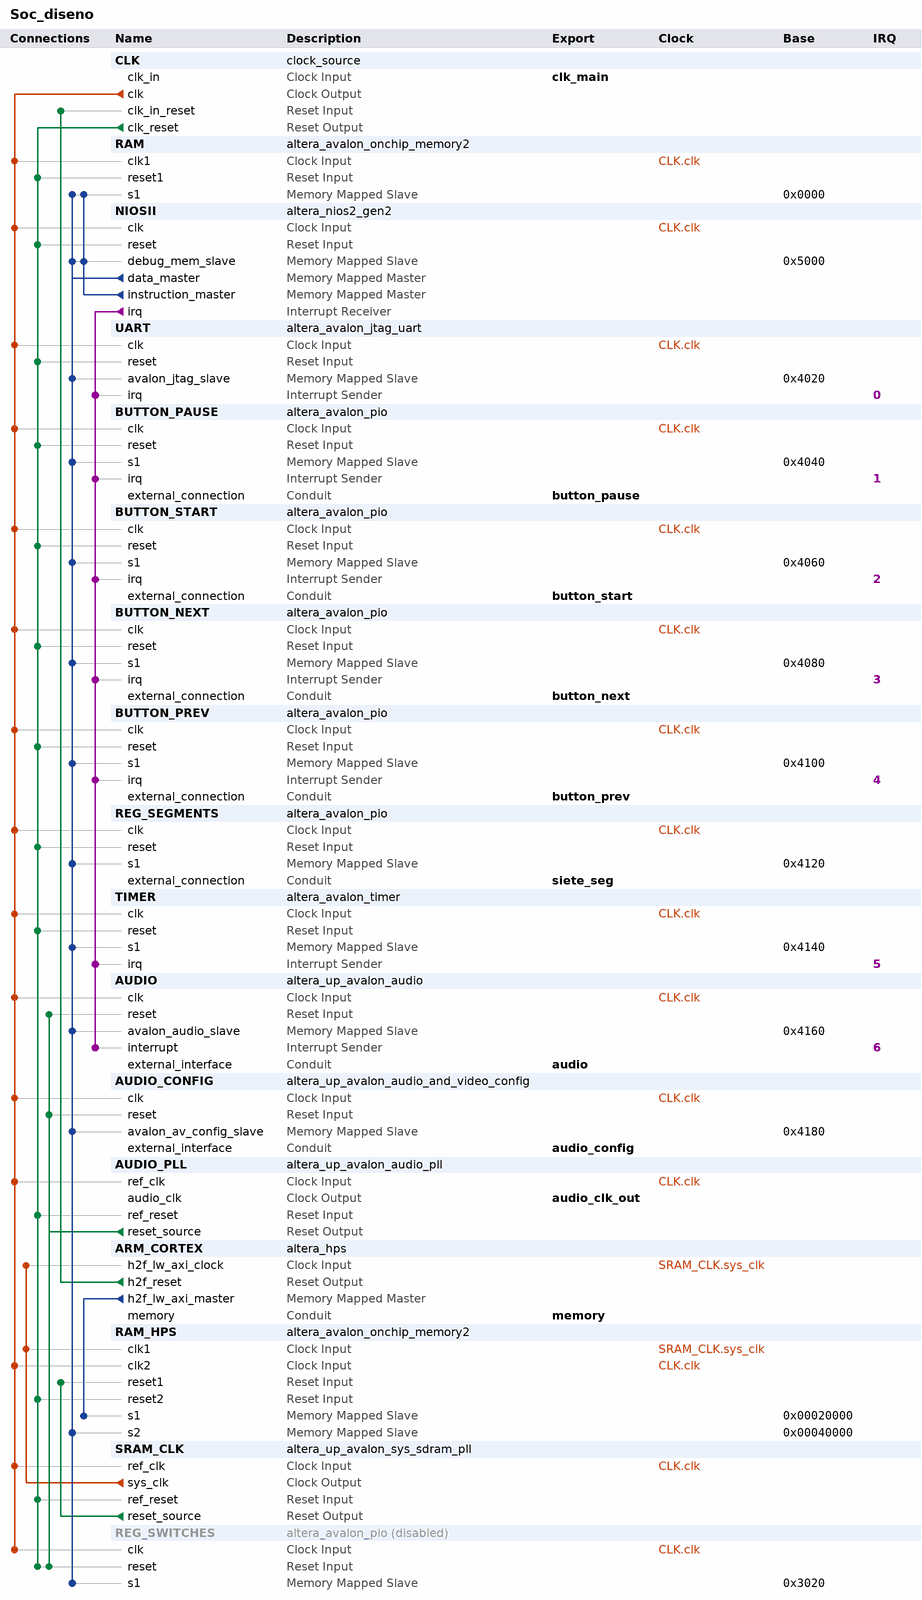
[diagram p0: system contents]
# Platform Designer (Qsys) system Soc_diseno, Cyclone V 5CSEMA5F31C6
# Parameters at their usual value, and those the tool derives, are not listed.
package require -exact qsys 18.1
create_system Soc_diseno
set_project_property DEVICE_FAMILY {Cyclone V}
set_project_property DEVICE 5CSEMA5F31C6

add_instance CLK clock_source 18.1
set_instance_parameter_value CLK clockFrequency 50000000

add_instance RAM altera_avalon_onchip_memory2 18.1
set_instance_parameter_value RAM dataWidth 32
set_instance_parameter_value RAM dualPort false
set_instance_parameter_value RAM initMemContent true
set_instance_parameter_value RAM initializationFileName onchip_mem.hex
set_instance_parameter_value RAM memorySize 16384

add_instance NIOSII altera_nios2_gen2 18.1
set_instance_parameter_value NIOSII dcache_size 2048
set_instance_parameter_value NIOSII exceptionSlave RAM.s1
set_instance_parameter_value NIOSII icache_size 4096
set_instance_parameter_value NIOSII impl Tiny
set_instance_parameter_value NIOSII resetSlave RAM.s1

add_instance UART altera_avalon_jtag_uart 18.1
set_instance_parameter_value UART simInteractiveOptions NO_INTERACTIVE_WINDOWS

add_instance BUTTON_PAUSE altera_avalon_pio 18.1
set_instance_parameter_value BUTTON_PAUSE bitClearingEdgeCapReg true
set_instance_parameter_value BUTTON_PAUSE captureEdge true
set_instance_parameter_value BUTTON_PAUSE direction Input
set_instance_parameter_value BUTTON_PAUSE edgeType FALLING
set_instance_parameter_value BUTTON_PAUSE generateIRQ true
set_instance_parameter_value BUTTON_PAUSE irqType EDGE
set_instance_parameter_value BUTTON_PAUSE width 1

add_instance BUTTON_START altera_avalon_pio 18.1
set_instance_parameter_value BUTTON_START bitClearingEdgeCapReg true
set_instance_parameter_value BUTTON_START captureEdge true
set_instance_parameter_value BUTTON_START direction Input
set_instance_parameter_value BUTTON_START edgeType FALLING
set_instance_parameter_value BUTTON_START generateIRQ true
set_instance_parameter_value BUTTON_START irqType EDGE
set_instance_parameter_value BUTTON_START width 1

add_instance BUTTON_NEXT altera_avalon_pio 18.1
set_instance_parameter_value BUTTON_NEXT bitClearingEdgeCapReg true
set_instance_parameter_value BUTTON_NEXT captureEdge true
set_instance_parameter_value BUTTON_NEXT direction Input
set_instance_parameter_value BUTTON_NEXT edgeType FALLING
set_instance_parameter_value BUTTON_NEXT generateIRQ true
set_instance_parameter_value BUTTON_NEXT irqType EDGE
set_instance_parameter_value BUTTON_NEXT width 1

add_instance BUTTON_PREV altera_avalon_pio 18.1
set_instance_parameter_value BUTTON_PREV bitClearingEdgeCapReg true
set_instance_parameter_value BUTTON_PREV captureEdge true
set_instance_parameter_value BUTTON_PREV direction Input
set_instance_parameter_value BUTTON_PREV edgeType FALLING
set_instance_parameter_value BUTTON_PREV generateIRQ true
set_instance_parameter_value BUTTON_PREV irqType EDGE
set_instance_parameter_value BUTTON_PREV width 1

add_instance REG_SEGMENTS altera_avalon_pio 18.1
set_instance_parameter_value REG_SEGMENTS direction Output
set_instance_parameter_value REG_SEGMENTS width 28

add_instance TIMER altera_avalon_timer 18.1
set_instance_parameter_value TIMER fixedPeriod true
set_instance_parameter_value TIMER period 1
set_instance_parameter_value TIMER periodUnits SEC

add_instance AUDIO altera_up_avalon_audio 18.0
set_instance_parameter_value AUDIO audio_in false
set_instance_parameter_value AUDIO avalon_bus_type {Memory Mapped}
set_instance_parameter_value AUDIO dw 16

add_instance AUDIO_CONFIG altera_up_avalon_audio_and_video_config 18.0
set_instance_parameter_value AUDIO_CONFIG audio_in {Microphone to ADC}
set_instance_parameter_value AUDIO_CONFIG bit_length 16
set_instance_parameter_value AUDIO_CONFIG board DE1-SoC
set_instance_parameter_value AUDIO_CONFIG line_in_bypass false
set_instance_parameter_value AUDIO_CONFIG sampling_rate {48 kHz}

add_instance AUDIO_PLL altera_up_avalon_audio_pll 18.0
set_instance_parameter_value AUDIO_PLL gui_refclk 50.0

add_instance ARM_CORTEX altera_hps 18.1
set_instance_parameter_value ARM_CORTEX EMAC1_Mode N/A
set_instance_parameter_value ARM_CORTEX EMAC1_PinMuxing Unused
set_instance_parameter_value ARM_CORTEX F2SCLK_COLDRST_Enable false
set_instance_parameter_value ARM_CORTEX F2SCLK_DBGRST_Enable false
set_instance_parameter_value ARM_CORTEX F2SCLK_WARMRST_Enable false
set_instance_parameter_value ARM_CORTEX F2SINTERRUPT_Enable false
set_instance_parameter_value ARM_CORTEX F2S_Width 0
set_instance_parameter_value ARM_CORTEX FPGA_PERIPHERAL_OUTPUT_CLOCK_FREQ_EMAC0_GTX_CLK 125
set_instance_parameter_value ARM_CORTEX FPGA_PERIPHERAL_OUTPUT_CLOCK_FREQ_EMAC0_MD_CLK 2.5
set_instance_parameter_value ARM_CORTEX FPGA_PERIPHERAL_OUTPUT_CLOCK_FREQ_EMAC1_GTX_CLK 125
set_instance_parameter_value ARM_CORTEX FPGA_PERIPHERAL_OUTPUT_CLOCK_FREQ_EMAC1_MD_CLK 2.5
set_instance_parameter_value ARM_CORTEX HPS_PROTOCOL DDR3
set_instance_parameter_value ARM_CORTEX I2C0_Mode N/A
set_instance_parameter_value ARM_CORTEX I2C0_PinMuxing Unused
set_instance_parameter_value ARM_CORTEX I2C1_Mode N/A
set_instance_parameter_value ARM_CORTEX I2C1_PinMuxing Unused
set_instance_parameter_value ARM_CORTEX LWH2F_Enable true
set_instance_parameter_value ARM_CORTEX MEM_BANKADDR_WIDTH 3
set_instance_parameter_value ARM_CORTEX MEM_CLK_FREQ 300.0
set_instance_parameter_value ARM_CORTEX MEM_CLK_FREQ_MAX 400.0
set_instance_parameter_value ARM_CORTEX MEM_COL_ADDR_WIDTH 8
set_instance_parameter_value ARM_CORTEX MEM_DQ_WIDTH 8
set_instance_parameter_value ARM_CORTEX MEM_DRV_STR RZQ/6
set_instance_parameter_value ARM_CORTEX MEM_ROW_ADDR_WIDTH 12
set_instance_parameter_value ARM_CORTEX MEM_RTT_NOM {ODT Disabled}
set_instance_parameter_value ARM_CORTEX MEM_RTT_WR {Dynamic ODT off}
set_instance_parameter_value ARM_CORTEX MEM_TCL 7
set_instance_parameter_value ARM_CORTEX MEM_TFAW_NS 37.5
set_instance_parameter_value ARM_CORTEX MEM_TINIT_US 499
set_instance_parameter_value ARM_CORTEX MEM_TMRD_CK 3
set_instance_parameter_value ARM_CORTEX MEM_TRAS_NS 40.0
set_instance_parameter_value ARM_CORTEX MEM_TRCD_NS 15.0
set_instance_parameter_value ARM_CORTEX MEM_TREFI_US 7.0
set_instance_parameter_value ARM_CORTEX MEM_TRFC_NS 75.0
set_instance_parameter_value ARM_CORTEX MEM_TRP_NS 15.0
set_instance_parameter_value ARM_CORTEX MEM_TWTR 2
set_instance_parameter_value ARM_CORTEX MEM_VENDOR JEDEC
set_instance_parameter_value ARM_CORTEX MEM_WTCL 6
set_instance_parameter_value ARM_CORTEX QSPI_Mode N/A
set_instance_parameter_value ARM_CORTEX QSPI_PinMuxing Unused
set_instance_parameter_value ARM_CORTEX REF_CLK_FREQ 125.0
set_instance_parameter_value ARM_CORTEX S2FCLK_USER2CLK 5
set_instance_parameter_value ARM_CORTEX S2F_Width 0
set_instance_parameter_value ARM_CORTEX SDIO_Mode N/A
set_instance_parameter_value ARM_CORTEX SDIO_PinMuxing Unused
set_instance_parameter_value ARM_CORTEX SPIM1_Mode N/A
set_instance_parameter_value ARM_CORTEX SPIM1_PinMuxing Unused
set_instance_parameter_value ARM_CORTEX STM_Enable false
set_instance_parameter_value ARM_CORTEX TIMING_BOARD_AC_SKEW 0.02
set_instance_parameter_value ARM_CORTEX TIMING_BOARD_AC_TO_CK_SKEW 0.0
set_instance_parameter_value ARM_CORTEX TIMING_BOARD_DQ_TO_DQS_SKEW 0.0
set_instance_parameter_value ARM_CORTEX TIMING_BOARD_MAX_CK_DELAY 0.6
set_instance_parameter_value ARM_CORTEX TIMING_BOARD_MAX_DQS_DELAY 0.6
set_instance_parameter_value ARM_CORTEX TIMING_BOARD_SKEW_BETWEEN_DQS 0.02
set_instance_parameter_value ARM_CORTEX TIMING_BOARD_SKEW_CKDQS_DIMM_MAX 0.01
set_instance_parameter_value ARM_CORTEX TIMING_BOARD_SKEW_CKDQS_DIMM_MIN -0.01
set_instance_parameter_value ARM_CORTEX TIMING_BOARD_SKEW_WITHIN_DQS 0.02
set_instance_parameter_value ARM_CORTEX TIMING_TDH 125
set_instance_parameter_value ARM_CORTEX TIMING_TDQSCK 400
set_instance_parameter_value ARM_CORTEX TIMING_TDQSQ 120
set_instance_parameter_value ARM_CORTEX TIMING_TDS 50
set_instance_parameter_value ARM_CORTEX TIMING_TIH 250
set_instance_parameter_value ARM_CORTEX TIMING_TIS 175
set_instance_parameter_value ARM_CORTEX TIMING_TQSH 0.38
set_instance_parameter_value ARM_CORTEX UART0_Mode N/A
set_instance_parameter_value ARM_CORTEX UART0_PinMuxing Unused
set_instance_parameter_value ARM_CORTEX USB1_Mode N/A
set_instance_parameter_value ARM_CORTEX USB1_PinMuxing Unused
set_instance_parameter_value ARM_CORTEX desired_cfg_clk_mhz 100.0
set_instance_parameter_value ARM_CORTEX desired_qspi_clk_mhz 400.0

add_instance RAM_HPS altera_avalon_onchip_memory2 18.1
set_instance_parameter_value RAM_HPS dataWidth 32
set_instance_parameter_value RAM_HPS dualPort true
set_instance_parameter_value RAM_HPS initMemContent true
set_instance_parameter_value RAM_HPS initializationFileName onchip_mem.hex
set_instance_parameter_value RAM_HPS memorySize 131072

add_instance SRAM_CLK altera_up_avalon_sys_sdram_pll 18.0
set_instance_parameter_value SRAM_CLK CV_boards DE1-SoC
set_instance_parameter_value SRAM_CLK gui_outclk 50.0
set_instance_parameter_value SRAM_CLK gui_refclk 50.0

add_instance REG_SWITCHES altera_avalon_pio 18.1
set_instance_property REG_SWITCHES ENABLED false
set_instance_parameter_value REG_SWITCHES bitClearingEdgeCapReg true
set_instance_parameter_value REG_SWITCHES captureEdge true
set_instance_parameter_value REG_SWITCHES direction Input
set_instance_parameter_value REG_SWITCHES width 10

# connections
add_connection CLK.clk AUDIO.clk clock
add_connection CLK.clk AUDIO_CONFIG.clk clock
add_connection CLK.clk AUDIO_PLL.ref_clk clock
add_connection CLK.clk BUTTON_NEXT.clk clock
add_connection CLK.clk BUTTON_PAUSE.clk clock
add_connection CLK.clk BUTTON_PREV.clk clock
add_connection CLK.clk BUTTON_START.clk clock
add_connection CLK.clk NIOSII.clk clock
add_connection CLK.clk RAM.clk1 clock
add_connection CLK.clk RAM_HPS.clk2 clock
add_connection CLK.clk REG_SEGMENTS.clk clock
add_connection CLK.clk REG_SWITCHES.clk clock
add_connection CLK.clk SRAM_CLK.ref_clk clock
add_connection CLK.clk TIMER.clk clock
add_connection CLK.clk UART.clk clock
add_connection SRAM_CLK.sys_clk ARM_CORTEX.h2f_lw_axi_clock clock
add_connection SRAM_CLK.sys_clk RAM_HPS.clk1 clock
add_connection ARM_CORTEX.h2f_reset CLK.clk_in_reset reset
add_connection AUDIO_PLL.reset_source AUDIO.reset reset
add_connection AUDIO_PLL.reset_source AUDIO_CONFIG.reset reset
add_connection AUDIO_PLL.reset_source REG_SWITCHES.reset reset
add_connection CLK.clk_reset AUDIO_PLL.ref_reset reset
add_connection CLK.clk_reset BUTTON_NEXT.reset reset
add_connection CLK.clk_reset BUTTON_PAUSE.reset reset
add_connection CLK.clk_reset BUTTON_PREV.reset reset
add_connection CLK.clk_reset BUTTON_START.reset reset
add_connection CLK.clk_reset NIOSII.reset reset
add_connection CLK.clk_reset RAM.reset1 reset
add_connection CLK.clk_reset RAM_HPS.reset2 reset
add_connection CLK.clk_reset REG_SEGMENTS.reset reset
add_connection CLK.clk_reset REG_SWITCHES.reset reset
add_connection CLK.clk_reset SRAM_CLK.ref_reset reset
add_connection CLK.clk_reset TIMER.reset reset
add_connection CLK.clk_reset UART.reset reset
add_connection SRAM_CLK.reset_source RAM_HPS.reset1 reset
add_connection ARM_CORTEX.h2f_lw_axi_master RAM_HPS.s1 avalon
set_connection_parameter_value ARM_CORTEX.h2f_lw_axi_master/RAM_HPS.s1 baseAddress 0x00020000
add_connection NIOSII.data_master AUDIO.avalon_audio_slave avalon
set_connection_parameter_value NIOSII.data_master/AUDIO.avalon_audio_slave baseAddress 0x4160
add_connection NIOSII.data_master AUDIO_CONFIG.avalon_av_config_slave avalon
set_connection_parameter_value NIOSII.data_master/AUDIO_CONFIG.avalon_av_config_slave baseAddress 0x4180
add_connection NIOSII.data_master BUTTON_NEXT.s1 avalon
set_connection_parameter_value NIOSII.data_master/BUTTON_NEXT.s1 baseAddress 0x4080
add_connection NIOSII.data_master BUTTON_PAUSE.s1 avalon
set_connection_parameter_value NIOSII.data_master/BUTTON_PAUSE.s1 baseAddress 0x4040
add_connection NIOSII.data_master BUTTON_PREV.s1 avalon
set_connection_parameter_value NIOSII.data_master/BUTTON_PREV.s1 baseAddress 0x4100
add_connection NIOSII.data_master BUTTON_START.s1 avalon
set_connection_parameter_value NIOSII.data_master/BUTTON_START.s1 baseAddress 0x4060
add_connection NIOSII.data_master NIOSII.debug_mem_slave avalon
set_connection_parameter_value NIOSII.data_master/NIOSII.debug_mem_slave baseAddress 0x5000
add_connection NIOSII.data_master RAM.s1 avalon
set_connection_parameter_value NIOSII.data_master/RAM.s1 baseAddress 0x0000
add_connection NIOSII.data_master RAM_HPS.s2 avalon
set_connection_parameter_value NIOSII.data_master/RAM_HPS.s2 baseAddress 0x00040000
add_connection NIOSII.data_master REG_SEGMENTS.s1 avalon
set_connection_parameter_value NIOSII.data_master/REG_SEGMENTS.s1 baseAddress 0x4120
add_connection NIOSII.data_master REG_SWITCHES.s1 avalon
set_connection_parameter_value NIOSII.data_master/REG_SWITCHES.s1 baseAddress 0x3020
add_connection NIOSII.data_master TIMER.s1 avalon
set_connection_parameter_value NIOSII.data_master/TIMER.s1 baseAddress 0x4140
add_connection NIOSII.data_master UART.avalon_jtag_slave avalon
set_connection_parameter_value NIOSII.data_master/UART.avalon_jtag_slave baseAddress 0x4020
add_connection NIOSII.instruction_master NIOSII.debug_mem_slave avalon
set_connection_parameter_value NIOSII.instruction_master/NIOSII.debug_mem_slave baseAddress 0x5000
add_connection NIOSII.instruction_master RAM.s1 avalon
set_connection_parameter_value NIOSII.instruction_master/RAM.s1 baseAddress 0x0000
add_connection NIOSII.irq AUDIO.interrupt interrupt
set_connection_parameter_value NIOSII.irq/AUDIO.interrupt irqNumber 6
add_connection NIOSII.irq BUTTON_NEXT.irq interrupt
set_connection_parameter_value NIOSII.irq/BUTTON_NEXT.irq irqNumber 3
add_connection NIOSII.irq BUTTON_PAUSE.irq interrupt
set_connection_parameter_value NIOSII.irq/BUTTON_PAUSE.irq irqNumber 1
add_connection NIOSII.irq BUTTON_PREV.irq interrupt
set_connection_parameter_value NIOSII.irq/BUTTON_PREV.irq irqNumber 4
add_connection NIOSII.irq BUTTON_START.irq interrupt
set_connection_parameter_value NIOSII.irq/BUTTON_START.irq irqNumber 2
add_connection NIOSII.irq TIMER.irq interrupt
set_connection_parameter_value NIOSII.irq/TIMER.irq irqNumber 5
add_connection NIOSII.irq UART.irq interrupt
set_connection_parameter_value NIOSII.irq/UART.irq irqNumber 0

# exported interfaces
add_interface audio conduit end
set_interface_property audio EXPORT_OF AUDIO.external_interface
add_interface audio_clk_out clock source
set_interface_property audio_clk_out EXPORT_OF AUDIO_PLL.audio_clk
add_interface audio_config conduit end
set_interface_property audio_config EXPORT_OF AUDIO_CONFIG.external_interface
add_interface button_next conduit end
set_interface_property button_next EXPORT_OF BUTTON_NEXT.external_connection
add_interface button_pause conduit end
set_interface_property button_pause EXPORT_OF BUTTON_PAUSE.external_connection
add_interface button_prev conduit end
set_interface_property button_prev EXPORT_OF BUTTON_PREV.external_connection
add_interface button_start conduit end
set_interface_property button_start EXPORT_OF BUTTON_START.external_connection
add_interface clk_main clock sink
set_interface_property clk_main EXPORT_OF CLK.clk_in
add_interface memory conduit end
set_interface_property memory EXPORT_OF ARM_CORTEX.memory
add_interface siete_seg conduit end
set_interface_property siete_seg EXPORT_OF REG_SEGMENTS.external_connection

set_interconnect_requirement {$system} qsys_mm.clockCrossingAdapter HANDSHAKE
set_interconnect_requirement {$system} qsys_mm.enableEccProtection FALSE
set_interconnect_requirement {$system} qsys_mm.insertDefaultSlave FALSE
set_interconnect_requirement {$system} qsys_mm.maxAdditionalLatency 1

save_system Soc_diseno.qsys
